# Altium schematic sheet 6_Channels_RX_V1_Schematic.SchDoc
size 270 x 219 mm; SheetNumber: 1; SheetTotal: 1
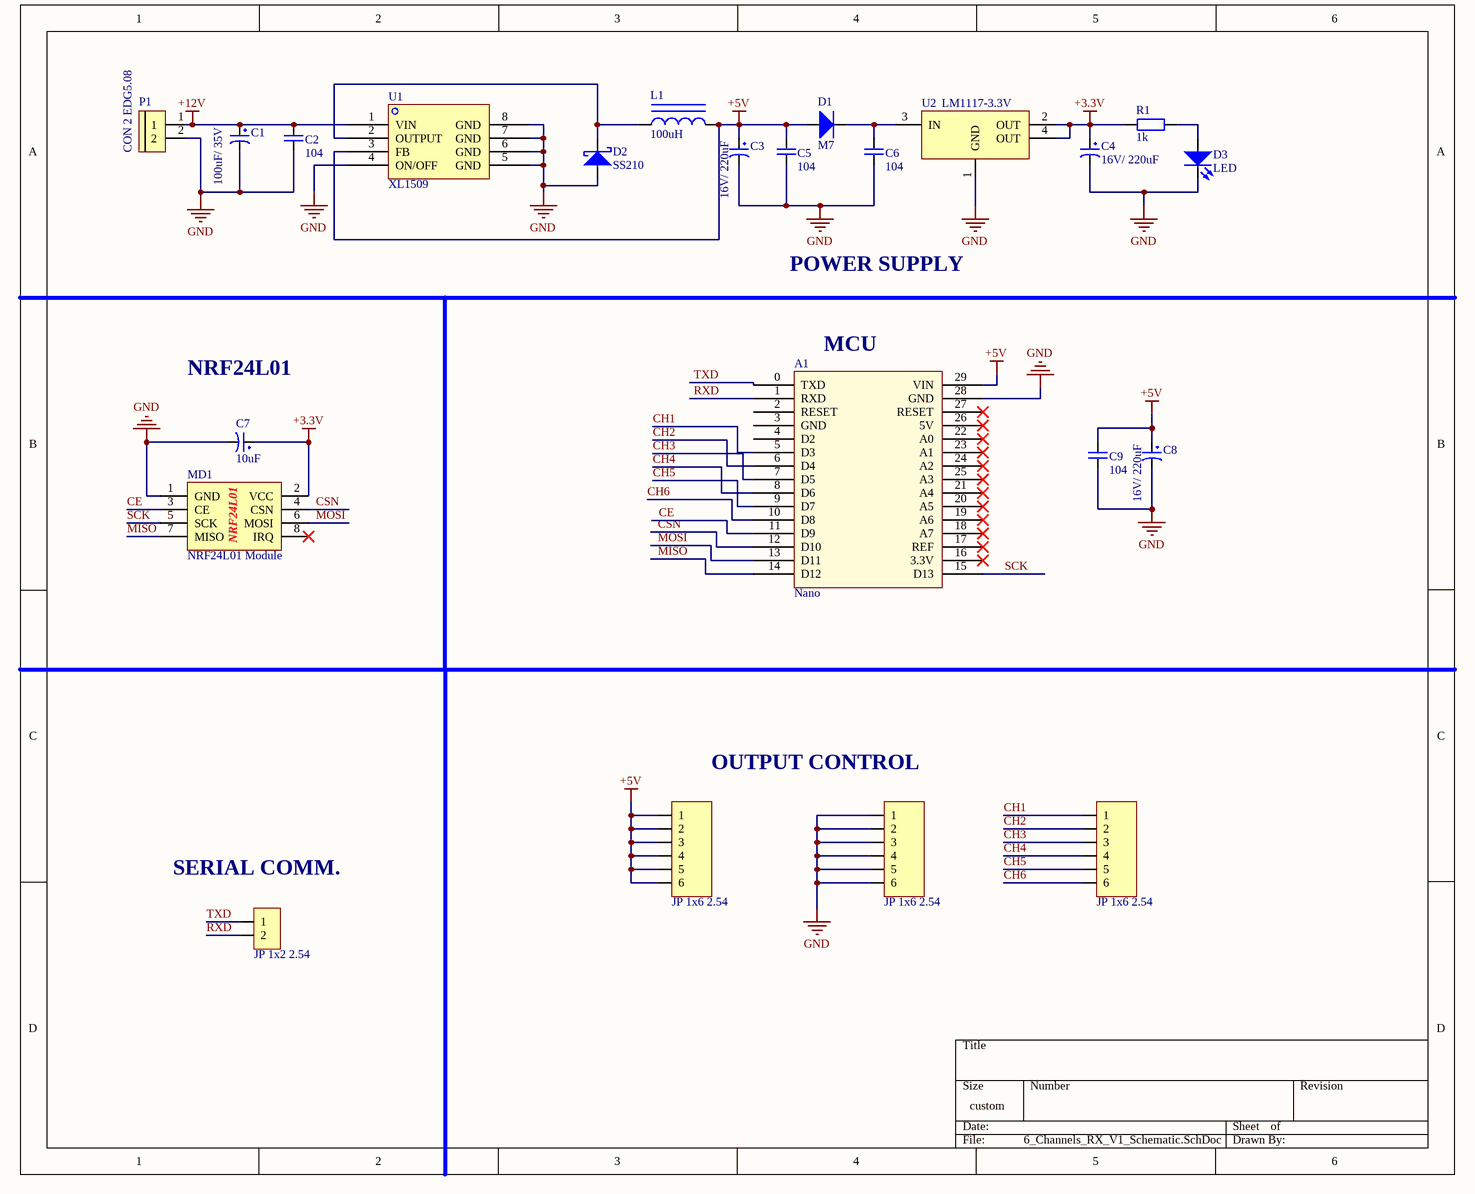
[diagram p0: 6_Channels_RX_V1_Schematic.SchDoc]

## Parts
A1  Nano  [Arduino nano]
C1  100uF/ 35V  [CAP SMD ALUMINUM D8]
C2  104  [SM-0805]
C3  16V/ 220uF  [CAP SMD ALUMINUM D8]
C4  16V/ 220uF  [CAP SMD ALUMINUM D8]
C5  104  [SM-0805]
C6  104  [SM-0805]
C7  10uF  [tu hoa 8mm]
C8  16V/ 220uF  [CAP SMD ALUMINUM D8]
C9  104  [SM-0805]
D1  M7  [DO-214AC]
D2  SS210  [DO-214AC]
D3  LED  [LED-3MM GRE]
JP1  JP 1x6 2.54  [JP 1x6 DT]
JP2  JP 1x6 2.54  [JP 1x6 DT]
JP3  JP 1x6 2.54  [JP 1x6 DT]
JP4  JP 1x2 2.54  [JP 1x2 DT]
L1  100uH  [INDUCTOR SMD 7342 7.3X7.3X4.2mm]
MD1  NRF24L01 Module  [NRF24L01]
P1  CON 2 EDG5.08  [CON 2 2EDG5.08]
R1  1k  [RESISTOR SMD 0805]
U1  XL1509  [SOP8]
U2  LM1117-3.3V  [SOT223-4N]

## Nets
+3.3V: C4.1 C7.1 MD1.2(VCC) R1.1 U2.2(OUT) U2.4(OUT)
+5V: A1.29(VIN) C3.1 C5.2 C8.1 C9.2 D1.1 JP1.1 JP1.2 JP1.3 JP1.4 JP1.5 JP1.6 L1.2 U1.3(FB)
+12V: C1.1 C2.2 P1.1 U1.1(VIN)
GND: A1.28(GND) C1.2 C2.1 C3.2 C4.2 C5.1 C6.1 C7.2 C8.2 C9.1 D2.1 D3.2 JP2.1 JP2.2 JP2.3 JP2.4 JP2.5 JP2.6 MD1.1(GND) P1.2 U1.4(ON/OFF) U1.5(GND) U1.6(GND) U1.7(GND) U1.8(GND) U2.1(GND)
CE: A1.11(D9) MD1.3(CE)
CH1: A1.5(D3) JP3.1
CH2: A1.6(D4) JP3.2
CH3: A1.7(D5) JP3.3
CH4: A1.8(D6) JP3.4
CH5: A1.9(D7) JP3.5
CH6: A1.10(D8) JP3.6
CSN: A1.12(D10) MD1.4(CSN)
MISO: A1.14(D12) MD1.7(MISO)
MOSI: A1.13(D11) MD1.6(MOSI)
RXD: A1.1(RXD) JP4.2
SCK: A1.15(D13) MD1.5(SCK)
TXD: A1.0(TXD) JP4.1
NetC6_2: C6.2 D1.2 U2.3(IN)
NetD2_2: D2.2 L1.1 U1.2(OUTPUT)
NetD3_1: D3.1 R1.2

Not connected (* = marked no-connect by the designer): A1 2(RESET) 3(GND) 4(D2) 16(3.3V)* 17(REF)* 18(A7)* 19(A6)* 20(A5)* 21(A4)* 22(A0)* 23(A1)* 24(A2)* 25(A3)* 26(5V)* 27(RESET)*; MD1 8(IRQ)*

## Notes on the sheet
- POWER SUPPLY
- NRF24L01
- (near A1) MCU
- OUTPUT CONTROL
- (near JP4) SERIAL COMM.
- (in symbol NRF24L01 Module) NRF24L01

## Library data of the parts
A1 = Arduino Nano
C1 C3 C4 C8 = Cap_Polar
C2 C5 C6 C9 = Cap_Non-Polar
C7 = Tu Hoa 100uF 35V 8x11: Cắm; Don_Vi: Con; So_Chan: 2; Ten_Linh_Kien: Tụ Hóa 100uF 35V 8x11MM; Ma_Hang: MH002807; Chung_Loai: Cắm; Kieu_Chan: *
D1 = Diode Standard: Part Number: LED 3 ly Single Colour; Pricing: *
D2 = Diode Schottky: Part Number: LED 3 ly Single Colour; Pricing: *
D3 = LED: LED Single; Value: LED 3 ly Single Colour
JP1-JP3 = JP 1x6 2.54 Duc Thang: Cắm; Ten_Linh_Kien: Jump Đơn Đực 2.54MM 1x40P Thẳng 11MM; Don_Vi: Con; Ma_Hang: MH000903; Ghi_Chu: *; Kieu_Chan: *; Chung_Loai: Cắm
JP4 = JP 1x2 2.54 Duc Thang: Cắm; Ten_Linh_Kien: Jump Đơn Đực 2.54MM 1x40P Thẳng 11MM; Don_Vi: Con; Ma_Hang: MH000903; Ghi_Chu: *; Kieu_Chan: *; Chung_Loai: Cắm
L1 = Inductor Iron: Magnetic-Core Inductor; Value: 150 mH
P1 = CON 2 EDG5.08: Cắm; Ten_Linh_Kien: CON 2 2EDG5.08-2P 5.08MM ( Xanh Cong); Ma_Hang: MH000759; Ghi_Chu: *; Don_Vi: Con; Kieu_Chan: *; Chung_Loai: Cắm
R1 = Resistor
U1 = XL1509: IC power sop8
U2 = LM1117: 800mA Low-Dropout Linear Regulator; Creator: Nguyen Ba Bien; Website: http://group3i.net